# Altium schematic sheet AS3933.SchDoc
size A4
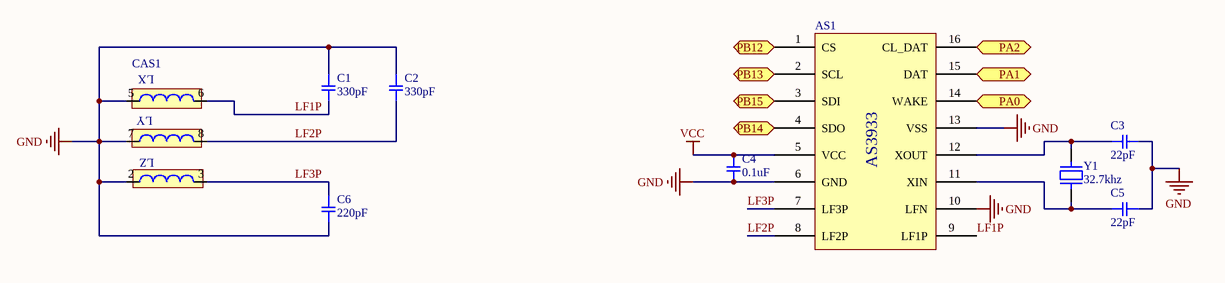
[diagram p0: AS3933.SchDoc]

## Parts
AS1  (no value)  [TSOP65P640X110-16N]
C1  330pF  [SMD-0805C]
C2  330pF  [SMD-0805C]
C3  22pF  [SMD-0805C]
C4  0.1uF  [SMD-0805C]
C5  22pF  [SMD-0805C]
C6  220pF  [SMD-0805C]
CAS1  CAS143-47  [CAS143-47]  (value not drawn)
Y1  32.7khz  [ABRACON ABS07]

## Ports
PA0, PA1, PA2, PB12, PB13, PB14, PB15

## Nets
GND: AS1.6(GND) AS1.10(LFN) AS1.13(VSS) C1.1 C2.1 C3.1 C4.2 C5.1 C6.2 CAS1.2 CAS1.5 CAS1.7
VCC: AS1.5(VCC) C4.1
LF1P: AS1.9(LF1P) C1.2 CAS1.6
LF2P: AS1.8(LF2P) C2.2 CAS1.8
LF3P: AS1.7(LF3P) C6.1 CAS1.3
PA0: AS1.14(WAKE) ; port PA0
PA1: AS1.15(DAT) ; port PA1
PA2: AS1.16(CL_DAT) ; port PA2
PB12: AS1.1(CS) ; port PB12
PB13: AS1.2(SCL) ; port PB13
PB14: AS1.4(SDO) ; port PB14
PB15: AS1.3(SDI) ; port PB15
NetAS1_11: AS1.11(XIN) C5.2 Y1.1
NetAS1_12: AS1.12(XOUT) C3.2 Y1.2

## Notes on the sheet
- (in symbol Component_1) AS3933; LX; LY; LZ

## Library data of the parts
AS1 CAS1 = Component_1
C1 C2 = CC0805GRNPO9BN331: Cap Ceramic 330pF 50V C0G 2%  0805; Manufacturer: Yageo; Part Number: CC0805GRNPO9BN331; Package / Case: 0805; Voltage: 50V; Tolerance: 2%; VALUE: 330pF
C3 C5 = CL21C220JBANNND: Cap Ceramic 22pF 50V C0G 5%0805; Manufacturer: Samsung Electro-Mechanics; Voltage: 100V; Tolerance: 1%; Part Number: CL21C220JBANNND; Package / Case: 0805; VALUE: 22pF
C4 = CL21B104JBCNNNC: CAP CER 0.1uF 50V X7T 0805; Part Number: GC321AD72E103KX01D; Manufacturer: Samsung Electro-Mechanics; Tolerance: 5%; Package / Case: 0805; Voltage: 50V; VALUE: 0.1uF
C6 = GCM2165C2A221FA16D: Cap Ceramic 220pF 100V C0G 1% 0805; Manufacturer: Murata Manufacturing; Part Number: GCM2165C2A221FA16D; Package / Case: 0805; Voltage: 100V; Tolerance: 1%; VALUE: 220pF
Y1 = Abracon Crystal ABS07: SMT Crystal; Value: 32.7khz